# Altium schematic sheet Sheet1.SchDoc
size A3; PageSetup: Record=PageOptions|CenterHorizontal=True|CenterVertical=True|PrintScale=1.00|XCorrection=1.00|YCorrection=1.00|PrintKind=1|BorderSize=5000000|LeftOffset=0|BottomOffset=0|Orientation=2|PaperLength=1000|PaperWidth=1000|Scale=100|PaperSource=7|PrintQuality=-3|MediaType=1|DitherType=10|PrintScaleMode=1|PaperKind=A4|PaperIndex=9
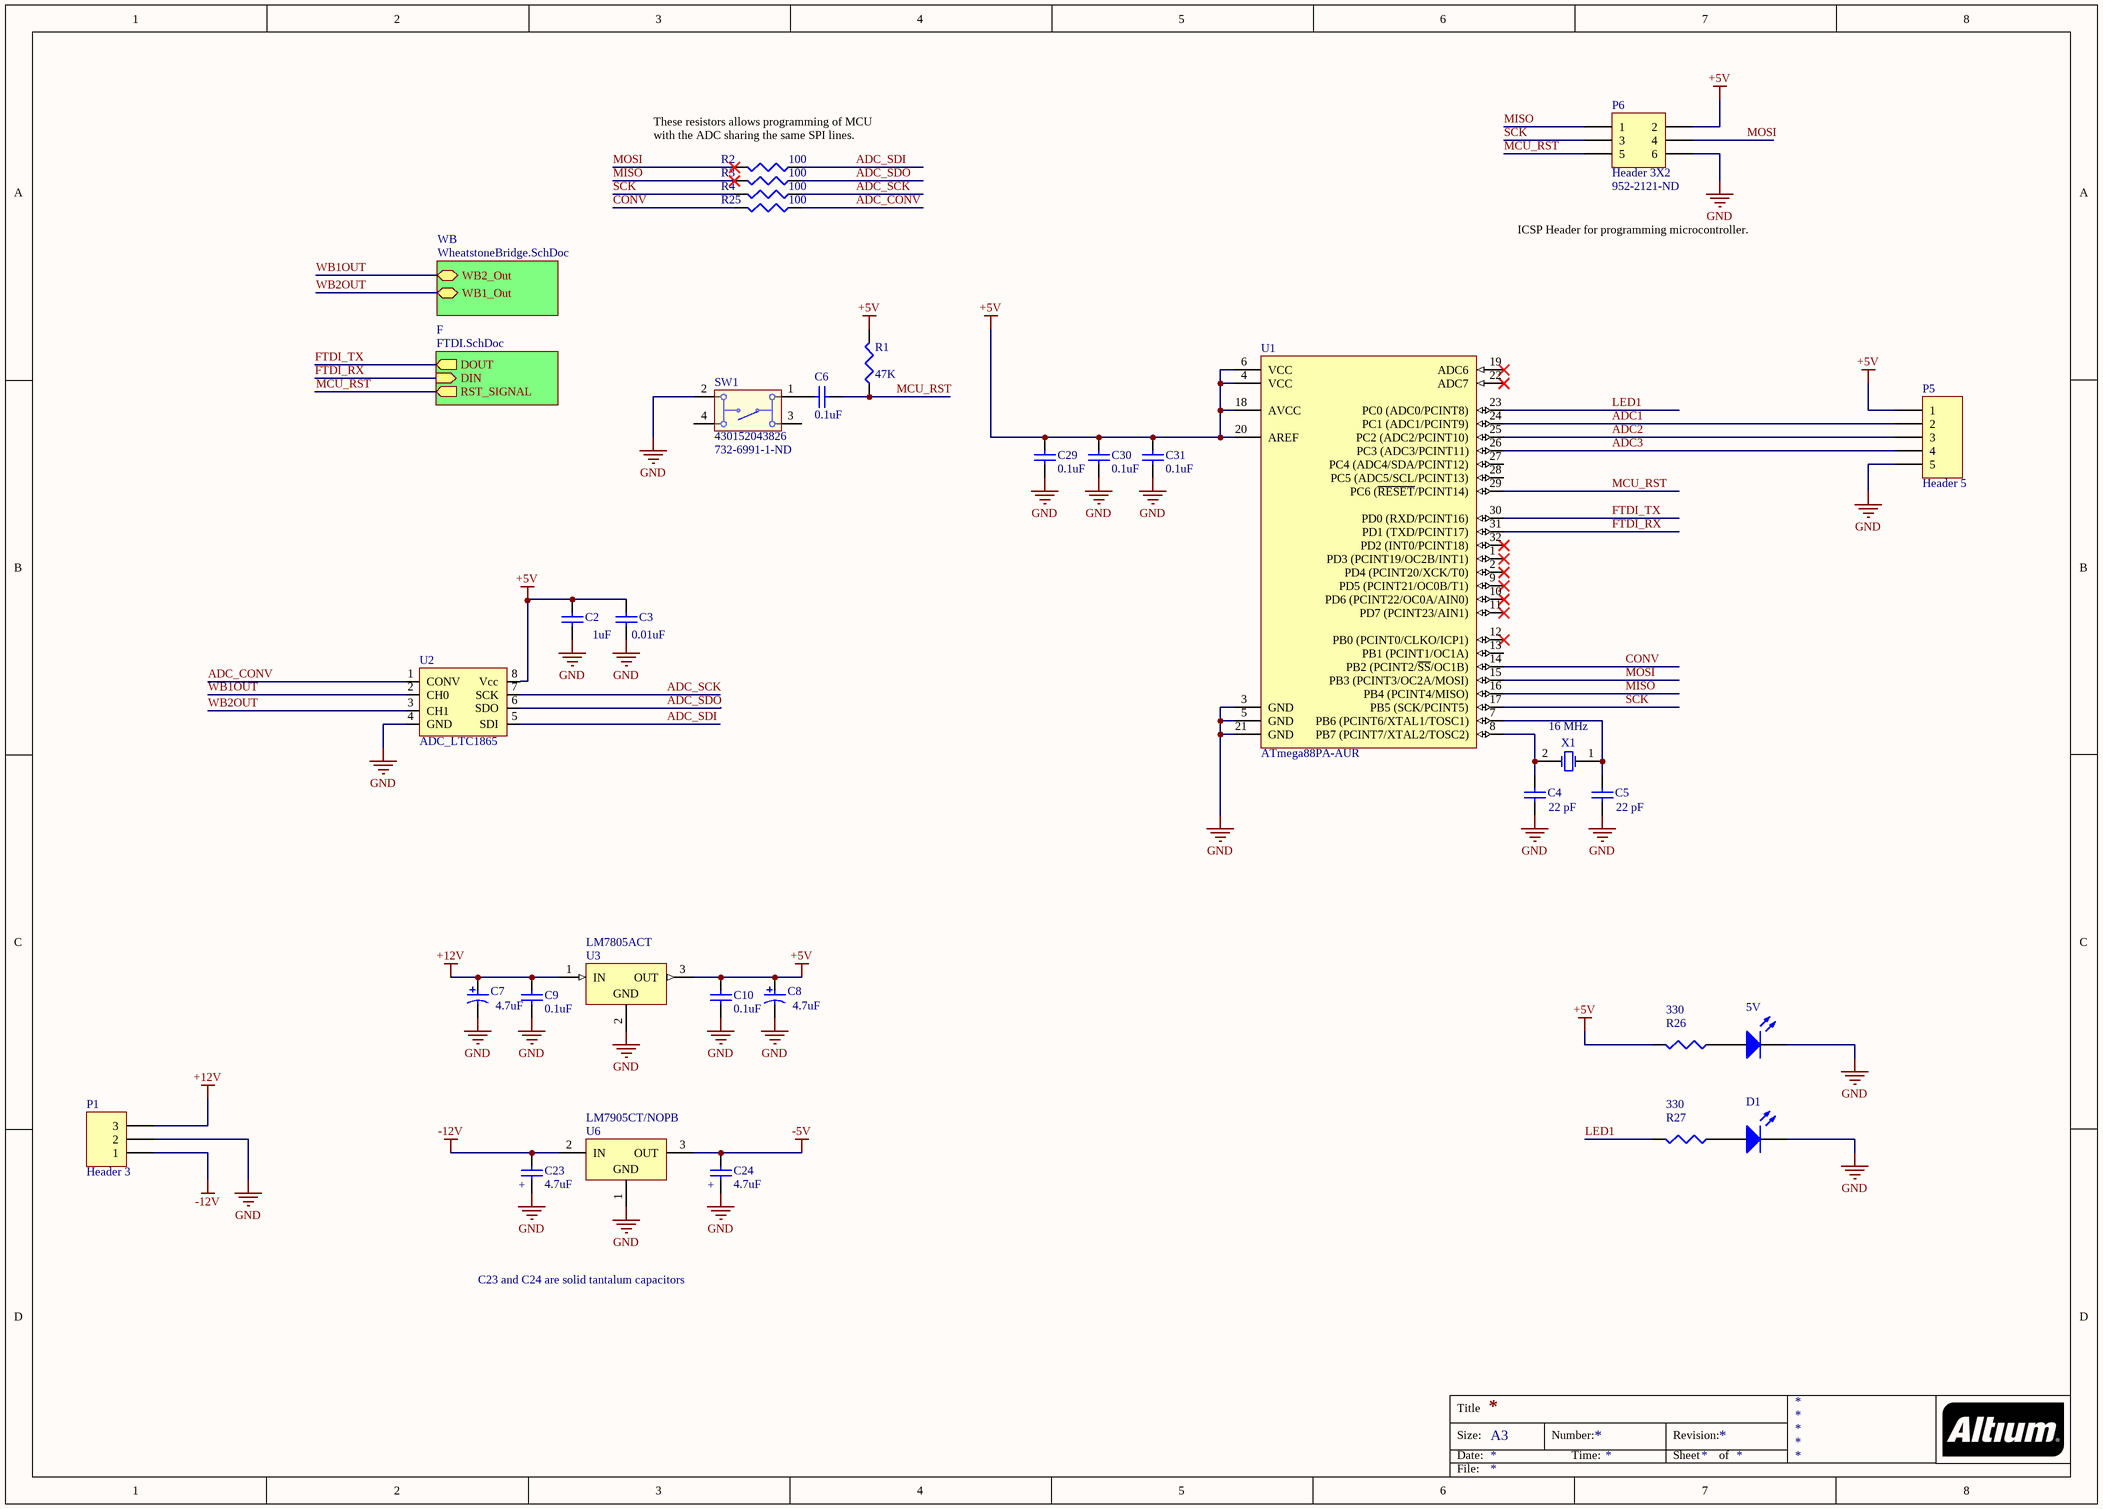
[diagram p0: Sheet1.SchDoc]

## Parts
5V  150060RS75000  [0603_A]  (value not drawn)
C2  value 1uF  [1608[0603]]  (hidden comment: Cap Semi)
C3  value 0.01uF  [1608[0603]]  (hidden comment: Cap Semi)
C4  value 22 pF  [1608[0603]]  (hidden comment: Cap Semi)
C5  value 22 pF  [1608[0603]]  (hidden comment: Cap Semi)
C6  value 0.1uF  [1608[0603]]  (hidden comment: Cap Semi)
C7  Capacitance: 4.7uF  [AVX-TAJ-A-2_N]  (hidden comment: TAJA475K016RNJ)
C8  Capacitance: 4.7uF  [AVX-TAJ-A-2_N]  (hidden comment: TAJA475K016RNJ)
C9  value 0.1uF  [1608[0603]]  (hidden comment: Cap Semi)
C10  value 0.1uF  [1608[0603]]  (hidden comment: Cap Semi)
C23  value 4.7uF  [1608[0603]]  (hidden comment: Cap Semi)
C24  value 4.7uF  [1608[0603]]  (hidden comment: Cap Semi)
C29  value 0.1uF  [1608[0603]]  (hidden comment: Cap Semi)
C30  value 0.1uF  [1608[0603]]  (hidden comment: Cap Semi)
C31  value 0.1uF  [1608[0603]]  (hidden comment: Cap Semi)
D1  150060RS75000  [0603_A]  (value not drawn)
P1  Header 3  [HDR1X3]
P5  Header 5  [HDR1X5]
P6  Header 3X2  Supplier Part Number 1: 952-2121-ND  [HDR2X3]
R1  value 47K  [J1-0603]  (hidden comment: Res3)
R2  value 100  [J1-0603]  (hidden comment: Res3)
R3  value 100  [J1-0603]  (hidden comment: Res3)
R4  value 100  [J1-0603]  (hidden comment: Res3)
R25  value 100  [J1-0603]  (hidden comment: Res3)
R26  value 330  [J1-0603]  (hidden comment: Res3)
R27  value 330  [J1-0603]  (hidden comment: Res3)
SW1  430152043826  Supplier Part Number 1: 732-6991-1-ND  [430152043826]
U1  ATmega88PA-AUR  [32A_N]
U2  ADC_LTC1865  [LTC1865_SOIC8]
U3  LM7805ACT  [FAIR-TO-220-3]
U6  LM7905CT/NOPB  [NDE0003A]
X1  Frequency: 16 MHz  [ABRA-ABLS2-2_V]  (hidden comment: ABLS2-16.000MHZ-D4Y-T)

## Sub-sheets
F = FTDI.SchDoc: DOUT (out), RST_SIGNAL (out), DIN (in)
WB = WheatstoneBridge.SchDoc: WB1_Out, WB2_Out

## Nets
+5V: C2.1 C3.1 C8.1 C10.1 C29.1 C30.1 C31.1 P5.1 P6.2 R1.2 R26.2 U1.4(VCC) U1.6(VCC) U1.18(AVCC) U1.20(AREF) U2.8(Vcc) U3.3(OUT)
+12V: C7.1 C9.1 P1.3 U3.1(IN)
-5V: C24.1 U6.3(OUT)
-12V: C23.1 P1.1 U6.2(IN)
GND: 5V.1(K) C2.2 C3.2 C4.1 C5.1 C7.2 C8.2 C9.2 C10.2 C23.2 C24.2 C29.2 C30.2 C31.2 D1.1(K) P1.2 P5.5 P6.6 SW1.2 U1.3(GND) U1.5(GND) U1.21(GND) U2.4(GND) U3.2(GND) U6.1(GND)
ADC1: P5.2 U1.24(PC1_(ADC1/PCINT9))
ADC2: P5.3 U1.25(PC2_(ADC2/PCINT10))
ADC3: P5.4 U1.26(PC3_(ADC3/PCINT11))
ADC_CONV: R25.1 U2.1(CONV)
ADC_SCK: R4.1 U2.7(SCK)
ADC_SDI: R2.1 U2.5(SDI)
ADC_SDO: R3.1 U2.6(SDO)
CONV: R25.2 U1.14(PB2_(PCINT2/~{SS}/OC1B))
FTDI_RX: U1.31(PD1_(TXD/PCINT17)) ; sheet F/DIN
FTDI_TX: U1.30(PD0_(RXD/PCINT16)) ; sheet F/DOUT
LED1: R27.2 U1.23(PC0_(ADC0/PCINT8))
MCU_RST: C6.1 P6.5 R1.1 U1.29(PC6_(~{RESET}/PCINT14)) ; sheet F/RST_SIGNAL
MISO: P6.1 R3.2 U1.16(PB4_(PCINT4/MISO))
MOSI: P6.4 R2.2 U1.15(PB3_(PCINT3/OC2A/MOSI))
SCK: P6.3 R4.2 U1.17(PB5_(SCK/PCINT5))
WB1OUT: U2.2(CH0) ; sheet WB/WB2_Out
WB2OUT: U2.3(CH1) ; sheet WB/WB1_Out
Net5V_2: 5V.2(A) R26.1
NetC4_2: C4.2 U1.8(PB7_(PCINT7/XTAL2/TOSC2)) X1.2(X2)
NetC5_2: C5.2 U1.7(PB6_(PCINT6/XTAL1/TOSC1)) X1.1(X1)
NetC6_2: C6.2 SW1.1
NetD1_2: D1.2(A) R27.1

Not connected (* = marked no-connect by the designer): SW1 3 4; U1 1(PD3_(PCINT19/OC2B/INT1))* 2(PD4_(PCINT20/XCK/T0))* 9(PD5_(PCINT21/OC0B/T1))* 10(PD6_(PCINT22/OC0A/AIN0))* 11(PD7_(PCINT23/AIN1))* 12(PB0_(PCINT0/CLKO/ICP1))* 13(PB1_(PCINT1/OC1A)) 19(ADC6)* 22(ADC7)* 27(PC4_(ADC4/SDA/PCINT12)) 28(PC5_(ADC5/SCL/PCINT13)) 32(PD2_(INT0/PCINT18))*

## Notes on the sheet
- These resistors allows programming of MCU with the ADC sharing the same SPI lines.
- ICSP Header for programming microcontroller.
- (near C23) +
- (near C24) +
- C23 and C24 are solid tantalum capacitors
- Title
- Size:
- Date:
- A3
- Number:
- Time:
- Revision:
- Sheet
- of
- File:

## Library data of the parts
5V D1 = CMP-1426-00001-1: SMD mono-color Chip LED, WL-SMCW, Red; Manufacturer: Wuerth Elektronik; Color: Red; PackageReference: 0603_A; ComponentLink2URL: http://katalog.we-online.com/led/datasheet/150060RS75000.pdf; ComponentLink1URL: http://www.we-online.com; ComponentLink1Description: Manufacturer URL; ComponentLink2Description: Datasheet; PartNumber: 150060RS75000; Supplier 1: Digi-Key; Supplier Part Number 1: 732-4978-1-ND
C2-C6 C9 C10 C23 C24 C29-C31 = Cap Semi: Capacitor (Semiconductor SIM Model); Published: 8-Jun-2000; LatestRevisionDate: 29-May-2009; LatestRevisionNote: IPC-7351 Footprint Added.; PackageReference: C1206; Publisher: Altium Limited; PackageDescription: Chip Capacitor; Supplier 1: Digi-Key
  C2 C3 C6 C9 C10 C23 C24 C29-C31: Supplier Part Number 1: 490-10901-1-ND
  C4 C5: Supplier Part Number 1: 478-1166-1-ND
C7 C8 = CMP-2100-03687-1: Standard Tantalum, 4.7 uF, +/- 10%, 16 V, -55 to 125 degC, 2-Pin SMD (1206), RoHS, Tape and Reel; Manufacturer: AVX; Dissipation Factor: 6%; Voltage Rating: 16V; Polarity: Polar; Resistance: 4Ohm; Leakage Current: 800nA; Lead Free: LeadFree; Radiation Hardening: No; Depth: 1.6mm; Package Description: 2-Pin Surface Mount Device, Body 3.2 x 1.65 mm; Package Quantity: 1; Max Operating Temperature: 125degC; Case/Package: 1206; Min Operating Temperature: -55degC; Datasheet URL: http://datasheets.avx.com/TAJ.pdf; Termination: SMD/SMT; Length: 3.2mm; Manufacturer URL: http://www.avx.com/; Height - Seated (Max): 0.071inch; Packaging: TapeandReel; Package Reference: TAJ-A-2; RoHSCompliant: True; Datasheet Version: 42401.0; Voltage Rating (DC): 16V; REACH SVHC: NoSVHC; ESR (Equivalent Series Resistance): 4Ohm; Tolerance: 10%; Case Code (Metric): 3216; Voltage: 16V; Height: 1.6mm; Number of Pins: 2; Lead Pitch: 1.1mm; Dielectric Material: Tantalum; Case Code (Imperial): 1206; Width: 1.6mm
P1 = Header 3: Header, 3-Pin; LatestRevisionDate: 17-Jul-2002; LatestRevisionNote: Re-released for DXP Platform.; Publisher: Altium Limited
P5 = Header 5: Header, 5-Pin; LatestRevisionDate: 17-Jul-2002; LatestRevisionNote: Re-released for DXP Platform.; Publisher: Altium Limited
P6 = Header 3X2: Header, 3-Pin, Dual row; LatestRevisionDate: 17-Jul-2002; LatestRevisionNote: Re-released for DXP Platform.; Publisher: Altium Limited; Supplier 1: Digi-Key
R1-R4 R25-R27 = Res3: Resistor; Published: 8-Jun-2000; LatestRevisionDate: 29-May-2009; LatestRevisionNote: IPC-7351 Footprint Added.; PackageReference: J1-0603; Publisher: Altium Limited; PackageDescription: Chip Resistor; Supplier 1: Digi-Key
  R1: Supplier Part Number 1: 311-47.0KHRCT-ND
  R2-R4 R25: Supplier Part Number 1: 311-100HRCT-ND
  R26 R27: Supplier Part Number 1: 311-330HRCT-ND
SW1 = CMP-1452-00001-1: WS-TASV SMD Tact Switch 6X6 mm; Manufacturer: Wuerth Elektronik; NoPins: 04; PartNumber: 430152043826; ComponentLink2Description: Datasheet; ComponentLink1Description: Manufacturer URL; ComponentLink1URL: http://www.we-online.com; ComponentLink2URL: http://katalog.we-online.de/em/datasheet/4301x2.pdf; PackageReference: 430152043826; Supplier 1: Digi-Key
U1 = CMP-0095-00212-2: 8-bit AVR Microcontroller, 8KB Flash, 512 Bytes EEPROM, 1KB SRAM, 32-pin TQFP, Industrial Grade (-40°C to 85°C), Reel; ComponentLink1URL: http://www.atmel.com/; DatasheetVersion: revD, May-2011; ComponentLink3Description: ATmega48A/48PA/88A/88PA/168A/168PA/328/328P Summary; PackageDescription: 32-Lead, 7x7x1.0 mm Body, 0.8mm Lead Pitch, Thin Profile Plastic Quad Flat Package (TQFP); ComponentLink1Description: Manufacturer URL; ComponentLink3URL: http://www.atmel.com/dyn/resources/prod_documents/8271S.pdf; ComponentLink2URL: http://www.atmel.com/dyn/resources/prod_documents/doc8271.pdf; PackageReference: 32A; RevisionNote: DatasheetVersion & PackageVersion updated. URLs added.; ComponentLink2Description: ATmega48A/48PA/88A/88PA/168A/168PA/328/328P Datasheet; Code_JEDEC: MS-026-ABA; PackageVersion: revC, Oct-2010
U3 = CMP-2000-04937-1: Positive Voltage Regulator, 5 V, 1 A, 0 to 125 degC, 3-Pin TO-220, RoHS, Tube; Manufacturer: Fairchild; Number of Outputs: 1; Typical Dropout Voltage @ Current: 2V@1A; Output Type: Fixed; Output Voltage: 5V; Quiescent Current: 6mA; Dropout Voltage Measurement Current: 1A; Line Regulation: 50mV; Maximum Input Voltage: 35V; Regulator Function: Linear; Load Regulation: 100mV; Package Type: TO-220; Mounting Type: ThroughHole; Height: 16.51mm; Maximum Operating Temperature: +125degC; Datasheet Version: Rev. 1.0.1, 05/2006; Package Reference: TO-220; Minimum Operating Temperature: 0degC; Manufacturer URL: https://www.fairchildsemi.com/; Package URL: https://www.fairchildsemi.com/package-drawings/TO/TO220B03.pdf; Length: 10.67mm; Series: LM78xx; Dimensions: 10.67x4.83x16.51mm; Polarity: Positive; Maximum Output Current: 1A; Pin Count: 3; Width: 4.83mm; Package Description: 3-Pin Through Hole Device, Body 10 x 4.5 mm, Pitch 2.54 mm; Datasheet URL: https://datasheet.ciiva.com/5816/1359194-5816420.pdf
U6 = CMP-0062-02481-3: 3-Terminal Negative Regulator, 3-pin TO-220, Pb-Free; Manufacturer: Texas Instruments; PackageTopMarking: NSUZXYTTE#*LM7905CT; CompType: LDO IC; PowerWise: N; PackageDescription: TO-220, Molded, 3 Lead, Straight; ComponentLink1Description: Datasheet URL; ComponentLink1URL: http://www.ti.com/general/docs/lit/getliterature.tsp?genericPartNumber=LM7905&fileType=pdf; PackageReference: NDE0003A; RoHS: Y; PinCount: 3
X1 = CMP-0277-00002-1: Low Profile Surface Mount Microprocessor Crystal, 16.000 MHz +/-30 ppm, 180 Ohm, -40 to 85 degC, 2-Pin 11.4 x 4.7 x 3.3 mm SMD, RoHS, Tape and Reel; Manufacturer: Abracon; Operation Mode: Fundamental or 3rd Overtone; Shunt Capacitance: 7 pF Max.; ESR: 180 Ohm; Load Capacitance: 18 pF; Mounting Technology: Surface Mount; PackageDescription: 2-Pin SMD, Body 11.4 x 4.7 mm, Height 3.3 mm; ComponentLink1URL: http://www.abracon.com/; Freq. Stability: +/- 30 ppm; ComponentLink2Description: Datasheet; PartNumber: ABLS2-16.000MHZ-D4Y-T; Operating Temp. Range: -40 to 85 degC; Packing: Tape and Reel; RoHS: TRUE; PackageReference: ABLS2-2; DatasheetVersion: Rev. 03.31.11; Freq. Tolerance: +/- 30 ppm; ComponentLink2URL: http://www.abracon.com/Resonators/ABLS2.pdf; ComponentLink1Description: Manufacturer URL; Supplier 1: Digi-Key; Supplier Part Number 1: 535-9875-1-ND